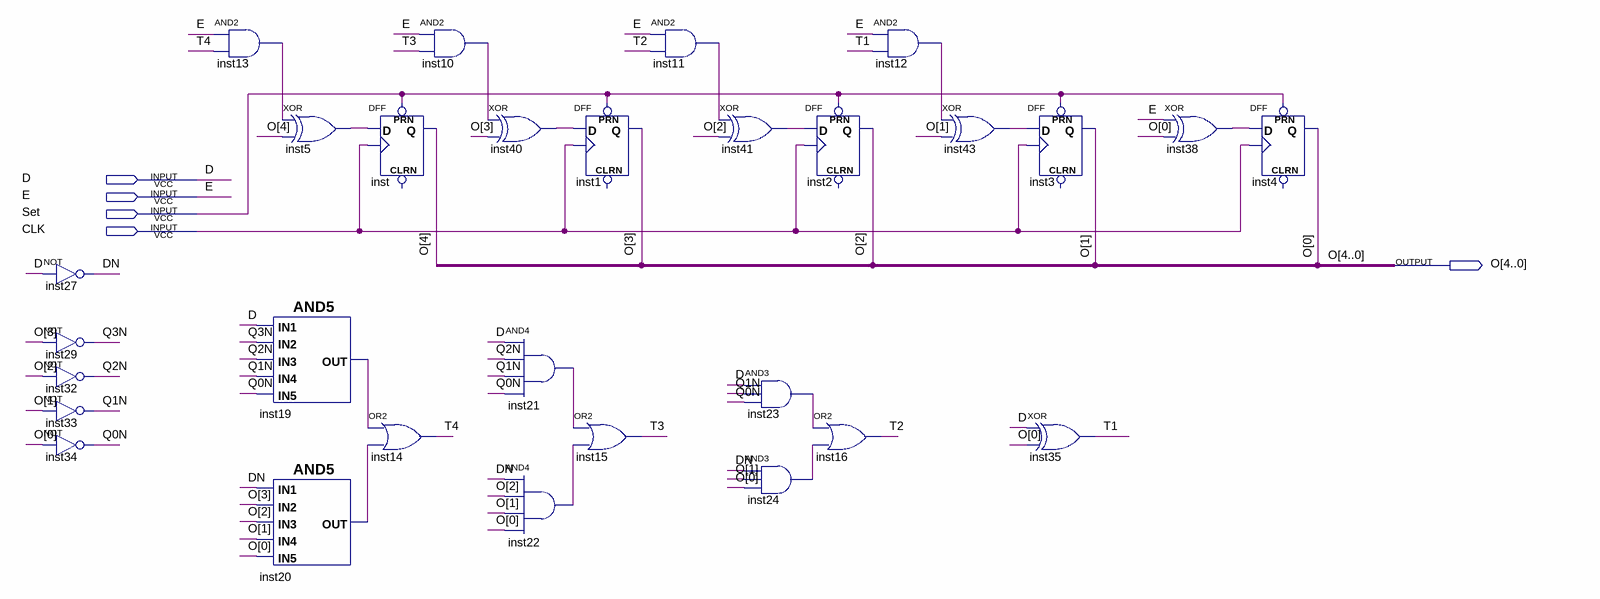
[diagram p0: schematic sheet]
// Quartus schematic TOP-1.bdf as structural Verilog: 29 symbols, 5 pins
module \TOP-1  (
  input  D,
  input  E,
  input  Set,
  input  CLK,
  output [4:0] O
);

  wire DN, inst5_out, inst10_out, inst11_out, inst12_out, inst13_out, inst19_out, inst20_out, inst21_out,
       inst22_out, inst23_out, inst24_out, inst38_out, inst40_out, inst41_out, inst43_out, Q0N, Q1N, Q2N,
       Q3N, T1, T2, T3, T4;

  not inst27 (DN, D);
  not inst29 (Q3N, O[3]);
  not inst32 (Q2N, O[2]);
  not inst33 (Q1N, O[1]);
  not inst34 (Q0N, O[0]);
  and inst13 (inst13_out, E, T4);
  and inst19 (inst19_out, D, Q3N, Q2N, Q1N, Q0N);
  and inst20 (inst20_out, DN, O[3], O[2], O[1], O[0]);
  xor inst5 (inst5_out, inst13_out, O[4]);
  DFF inst (.CLK(CLK), .D(inst5_out), .PRN(Set), .Q(O[4]));  // open: CLRN
  or inst14 (T4, inst19_out, inst20_out);
  and inst10 (inst10_out, E, T3);
  xor inst40 (inst40_out, inst10_out, O[3]);
  and inst21 (inst21_out, D, Q2N, Q1N, Q0N);
  and inst22 (inst22_out, DN, O[2], O[1], O[0]);
  DFF inst1 (.CLK(CLK), .D(inst40_out), .PRN(Set), .Q(O[3]));  // open: CLRN
  or inst15 (T3, inst21_out, inst22_out);
  and inst11 (inst11_out, E, T2);
  xor inst41 (inst41_out, inst11_out, O[2]);
  DFF inst2 (.CLK(CLK), .D(inst41_out), .PRN(Set), .Q(O[2]));  // open: CLRN
  and inst23 (inst23_out, D, Q1N, Q0N);
  and inst24 (inst24_out, DN, O[1], O[0]);
  and inst12 (inst12_out, E, T1);
  or inst16 (T2, inst23_out, inst24_out);
  xor inst43 (inst43_out, inst12_out, O[1]);
  DFF inst3 (.CLK(CLK), .D(inst43_out), .PRN(Set), .Q(O[1]));  // open: CLRN
  xor inst35 (T1, D, O[0]);
  xor inst38 (inst38_out, E, O[0]);
  DFF inst4 (.CLK(CLK), .D(inst38_out), .PRN(Set), .Q(O[0]));  // open: CLRN
endmodule
